# EAGLE design ESP8266_ESP-01_Breakout_2015-11-16 (EAGLE 7.4.0)
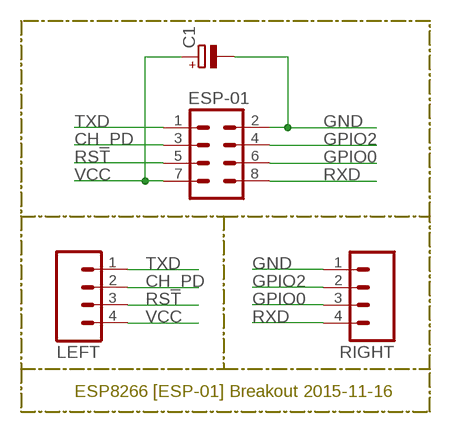
[diagram p0: schematic, sheet 1]

## Parts
C1  CPOL-EUB45181B  [B45181B]
ESP-01  M04X2  [2X4]
LEFT  M04LONGPADS  [1X04_LONGPADS]
RIGHT  M04LONGPADS  [1X04_LONGPADS]

## Nets
CH_PD: ESP-01.3 LEFT.2
GND: C1.- ESP-01.2 RIGHT.1
GPIO0: ESP-01.6 RIGHT.3
GPIO2: ESP-01.4 RIGHT.2
RST: ESP-01.5 LEFT.3
RXD: ESP-01.8 RIGHT.4
TXD: ESP-01.1 LEFT.1
VCC: C1.+ ESP-01.7 LEFT.4

## Notes on the sheet
- ESP8266 [ESP-01] Breakout 2015-11-16

## Library data of the parts
C1 = rcl:CPOL-EU: POLARIZED CAPACITOR, European symbol
ESP-01 = SparkFun-Connectors:M04X2: .1" header, two rows of four.
LEFT RIGHT = SparkFun-Connectors:M04: Header 4 Standard 4-pin 0.1" header. Use with straight break away headers (SKU : PRT-00116), right angle break away headers (PRT-00553), swiss pins (PRT-00743), machine pins (PRT-00117), and female headers (PRT-00115). Molex polarized connector foot print use with SKU : PRT-08231 with associated crimp pins and housings. 1MM SMD Version SKU: PRT-10208

## Board
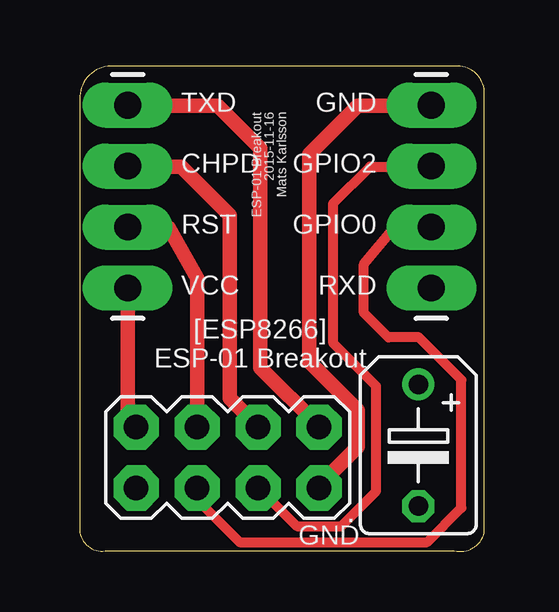
[diagram p1: board, top side]
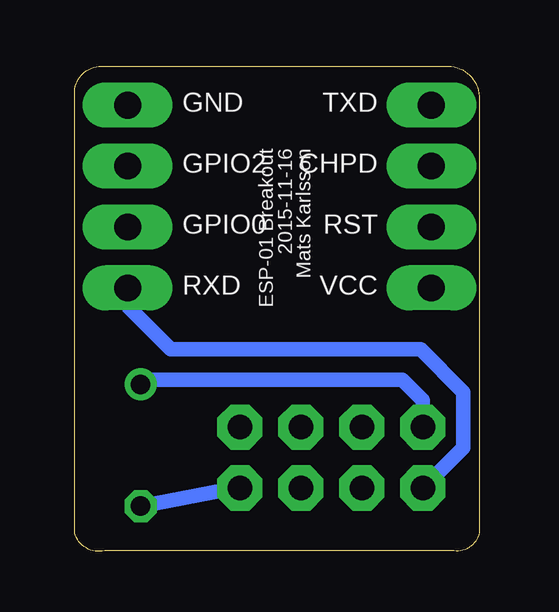
[diagram p2: board, bottom side, seen from below]

Size 16.86 x 20.22 mm. Coordinates in mm from the lower left corner, seen from the top.
Outline: 0,18.96 0,0.78 arc90 1.16,0.03 15.6,0.03 arc90 16.86,0.78 16.86,18.96 arc90 15.86,20.22 1.41,20.22 arc90 0,18.96
Copper layers (1*16): Top 0.035mm / dielectric 1.5mm / Bottom 0.035mm
Design rules "Elecrow_2-layer_eagle_rule": minimum track width 6mil, minimum drill 12mil, track to track 6mil, track to pad 6mil, pad to pad 6mil, via to via 6mil, smd to smd 0mil, copper to edge 10mil, drill to drill 10mil, minimum pad ring 10mil, minimum via ring 6mil, stop-mask expansion 2mil, vias tented up to drill 100mil, thermal gap 10mil

### Footprints (pad centres in the part's own frame; a part is rotated, then mirrored left to right if it is on the bottom)
B45181B = drill 0.813: + -2.54,0 | drill 0.813 octagon: - 2.54,0
2X4 = drill 1.016 pad 1.88 octagon: 1 -3.81,-1.27; 2 -3.81,1.27; 3 -1.27,-1.27; 4 -1.27,1.27; 5 1.27,-1.27; 6 1.27,1.27; 7 3.81,-1.27; 8 3.81,1.27
1X04_LONGPADS = drill 1.118 pad 1.88 long: 1 0,0; 2 2.54,0; 3 5.08,0; 4 7.62,0

### Placement (x,y rotation side)
C1  14.11,4.43 270 top
ESP-01  6.16,3.91 180 top
LEFT  2,18.6 270 top
RIGHT  14.65,18.6 270 top

### Tracks (layer width: path | path; a pad name or v marks a point on that pad's centre or on a via)
CH_PD
  Top 0.406: ESP-01.3 7.43,5.21 | 2.02,16.04 LEFT.2
  Top 0.61: 7.43,5.21 6.25,6.38 6.25,14 4.22,16.04 2.02,16.04
GND  (via drill 0.6)
  Top 0.406: v10.01,2.68 10.01,2.77 | 14.63,18.58 RIGHT.1
  Top 0.61: 10.01,2.77 11.59,4.35 11.59,5.88 9.56,7.91 9.56,16.54 11.59,18.58 14.63,18.58
  Bottom 0.61: C1.- v10.01,2.68 ESP-01.2
GPIO0
  Top 0.406: ESP-01.6 4.89,2.16 6.67,0.38 14.48,0.38 15.91,1.81 15.91,7.15 14.13,8.92 12.86,8.92 11.84,9.94 11.84,11.97 13.13,13.52 RIGHT.3
GPIO2
  Top 0.406: ESP-01.4 7.46,2.64 9.05,1.05 10.89,1.05 12.35,2.51 12.35,6.89 10.57,8.67 10.57,14.51 12.1,16.04 14.63,16.04 RIGHT.2
RST
  Top 0.406: 3.71,13.5 3.46,13.52
  Top 0.61: ESP-01.5 4.89,11.39 3.71,13.5 | 3.46,13.52 LEFT.3
RXD
  Bottom 0.61: ESP-01.8 0.67,4.33 0.67,6.64 2.44,8.42 12.86,8.42 14.64,10.19 14.64,10.96 RIGHT.4
TXD
  Top 0.406: ESP-01.1 9.97,5.21 | 2.02,18.58 LEFT.1
  Top 0.61: 9.97,5.21 7.52,7.65 7.52,16.8 5.75,18.58 2.02,18.58
VCC
  Top 0.61: LEFT.4 2,5.54 ESP-01.7
  Bottom 0.61: ESP-01.7 2.35,6.29 3.21,7.15 13.61,7.15 C1.+

### Text on the board
tPlace: TXD | ESP-01 Breakout / 2015-11-16 / Mats Karlsson | GND | CHPD | GPIO2 | RST | GPIO0 | VCC | RXD | [ESP8266] / ESP-01 Breakout | . | GND
bPlace: TXD | GND | ESP-01 Breakout / 2015-11-16 / Mats Karlsson | CHPD | GPIO2 | RST | GPIO0 | VCC | RXD